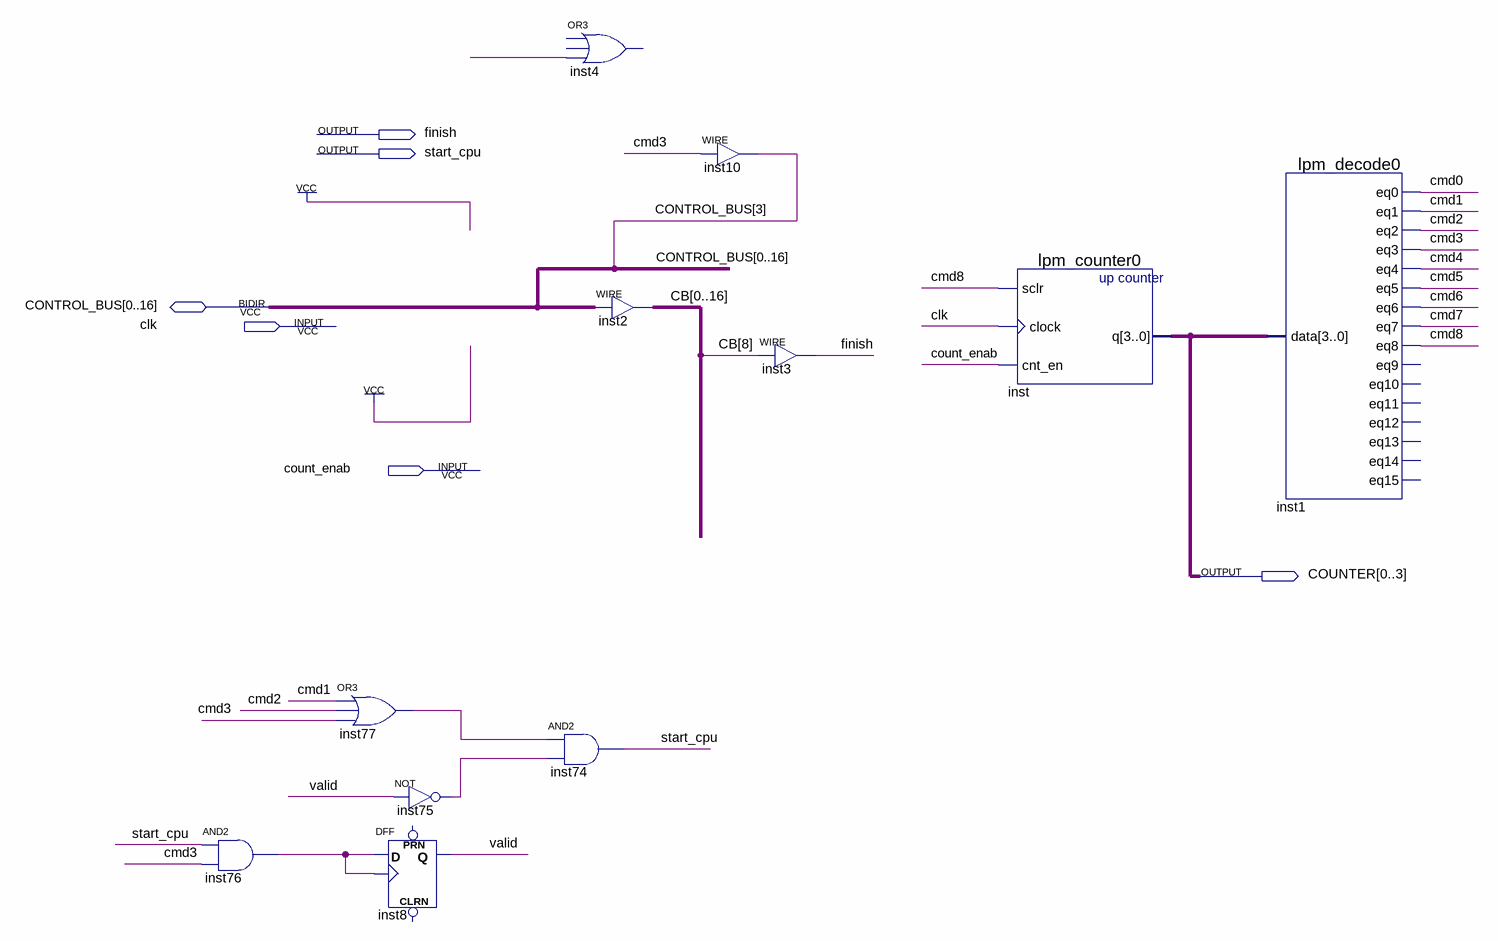
[diagram p0: schematic sheet]
// Quartus schematic CU_1.bdf as structural Verilog: 11 symbols, 6 pins
module CU_1 (
  input  clk,
  input  count_enab,
  inout  [0:16] CONTROL_BUS,
  output finish,
  output start_cpu,
  output [0:3] COUNTER
);

  wire cmd0, cmd1, cmd2, cmd3, cmd4, cmd5, cmd6, cmd7, cmd8, inst75_out, inst76_out, inst77_out, undriven,
       valid;
  wire [16:0] CB;

  and inst76 (inst76_out, start_cpu, cmd3);
  or inst77 (inst77_out, cmd1, cmd2, cmd3);
  not inst75 (inst75_out, valid);
  DFF inst8 (.CLK(inst76_out), .D(inst76_out), .Q(valid));  // open: CLRN, PRN
  // OR3 inst4 has open pins: IN1=open, IN2=open, IN3=undriven, OUT=open
  and inst74 (start_cpu, inst77_out, inst75_out);
  assign {CB[0], CB[1], CB[2], CB[3], CB[4], CB[5], CB[6], CB[7], CB[8], CB[9], CB[10], CB[11], CB[12], CB[13], CB[14], CB[15], CB[16]} = CONTROL_BUS;  // WIRE inst2
  assign CONTROL_BUS[3] = cmd3;  // WIRE inst10
  assign finish = CB[8];  // WIRE inst3
  lpm_counter0 inst (.sclr(cmd8), .clock(clk), .cnt_en(count_enab), .q(COUNTER));
  lpm_decode0 inst1 (
    .data(COUNTER), .eq0(cmd0), .eq1(cmd1), .eq2(cmd2), .eq3(cmd3), .eq4(cmd4), .eq5(cmd5), .eq6(cmd6),
    .eq7(cmd7), .eq8(cmd8));  // open: eq9, eq10, eq11, eq12, eq13, eq14, eq15
endmodule
